# EAGLE schematic single-optrode (EAGLE 6.6.0)
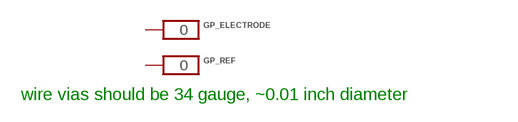
[diagram p0: schematic, sheet 1]

## Parts
GP_ELECTRODE  GOLDPIN_0.5ID_0.7OD  [GOLDPIN_0.5ID_0.7OD]
GP_REF  GOLDPIN_0.5ID_0.7OD  [GOLDPIN_0.5ID_0.7OD]
Unconnected: GP_ELECTRODE.P$1 GP_REF.P$1

## Notes on the sheet
- wire vias should be 34 gauge, ~0.01 inch diameter

## Library data of the parts
GP_ELECTRODE GP_REF = jonnew:GOLDPIN